# EAGLE schematic V1c_pcb (EAGLE 6.5.0)
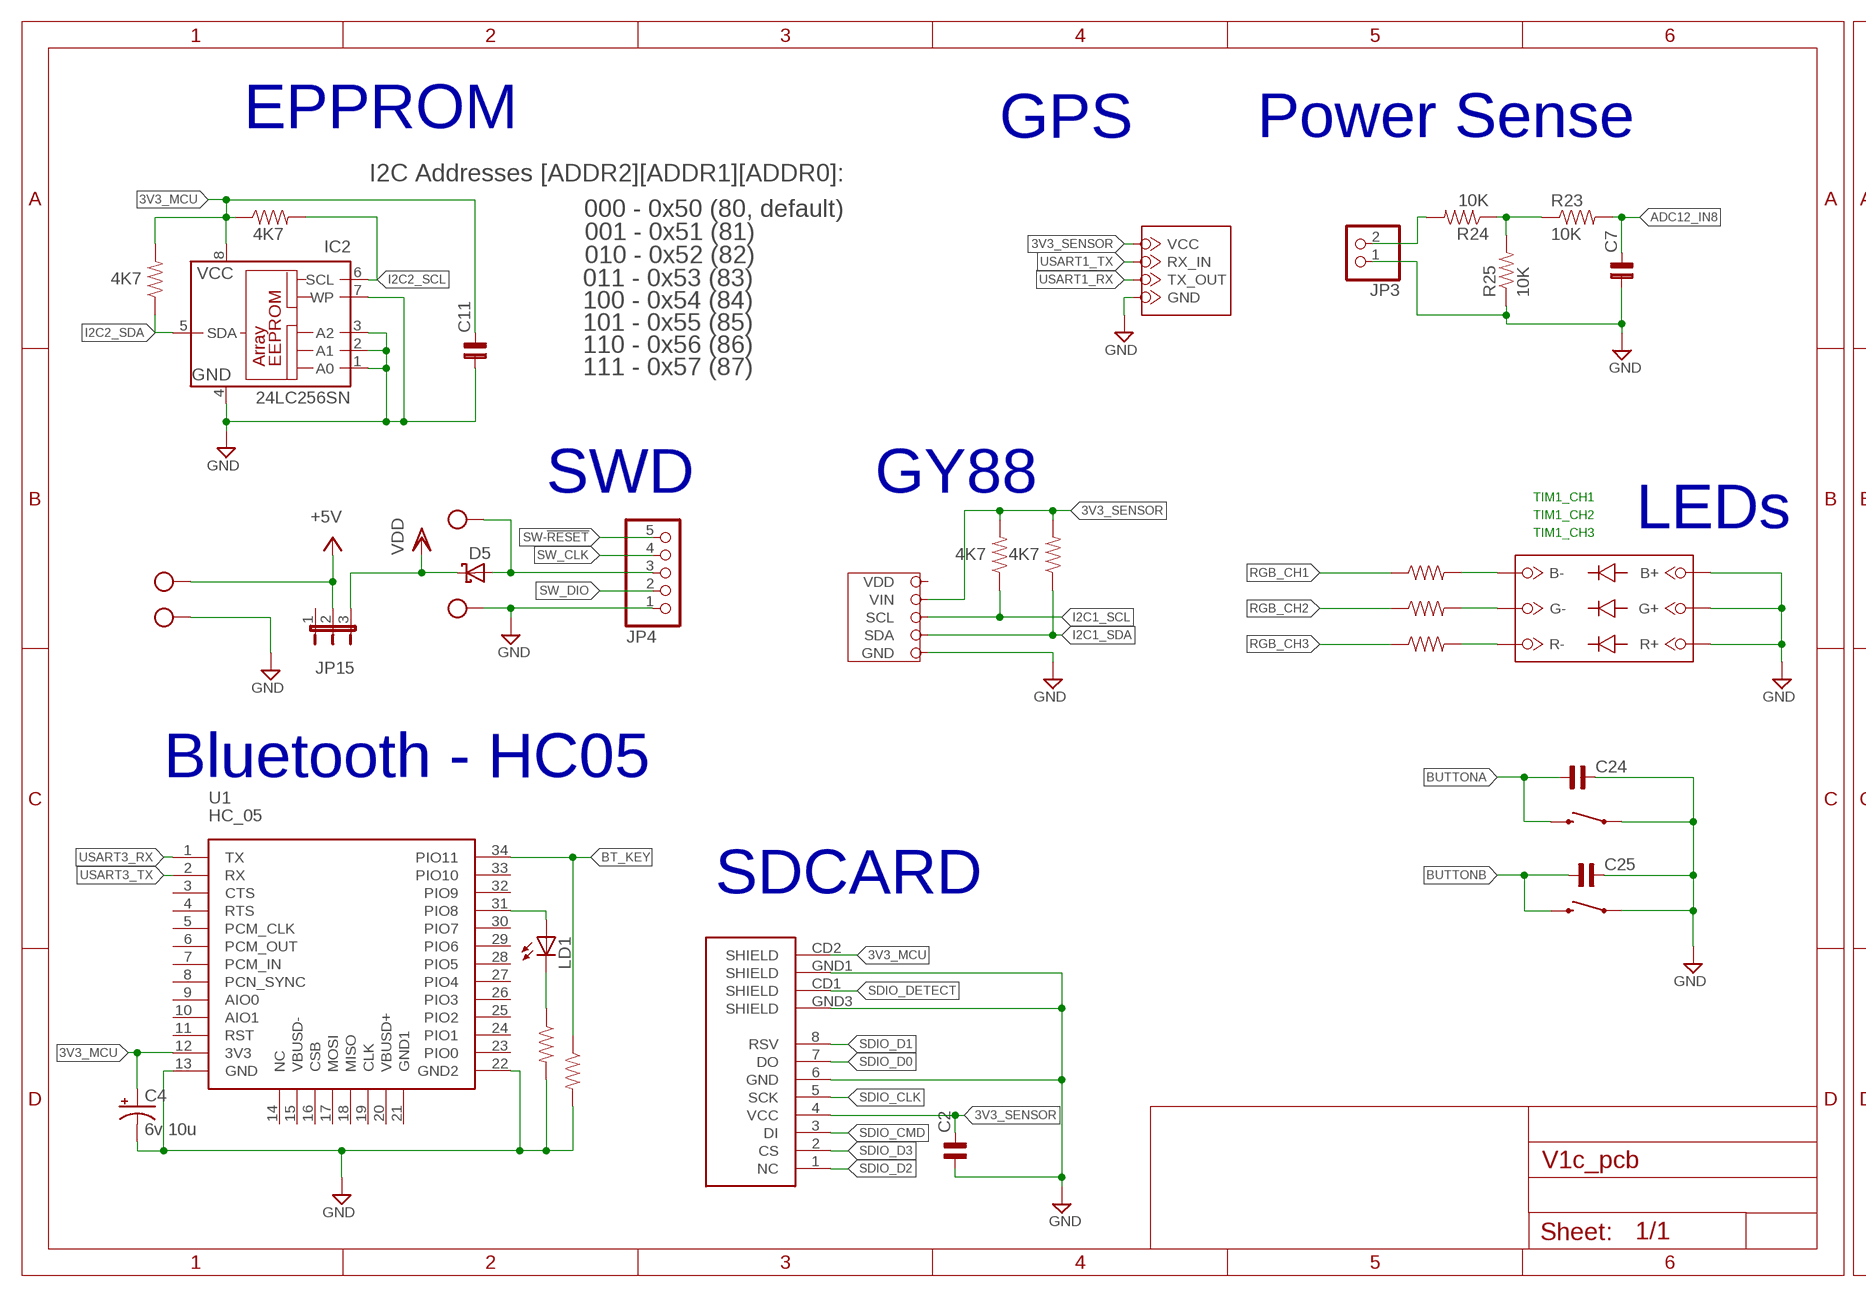
[diagram p0: schematic, sheet 1, part 1 of 2]
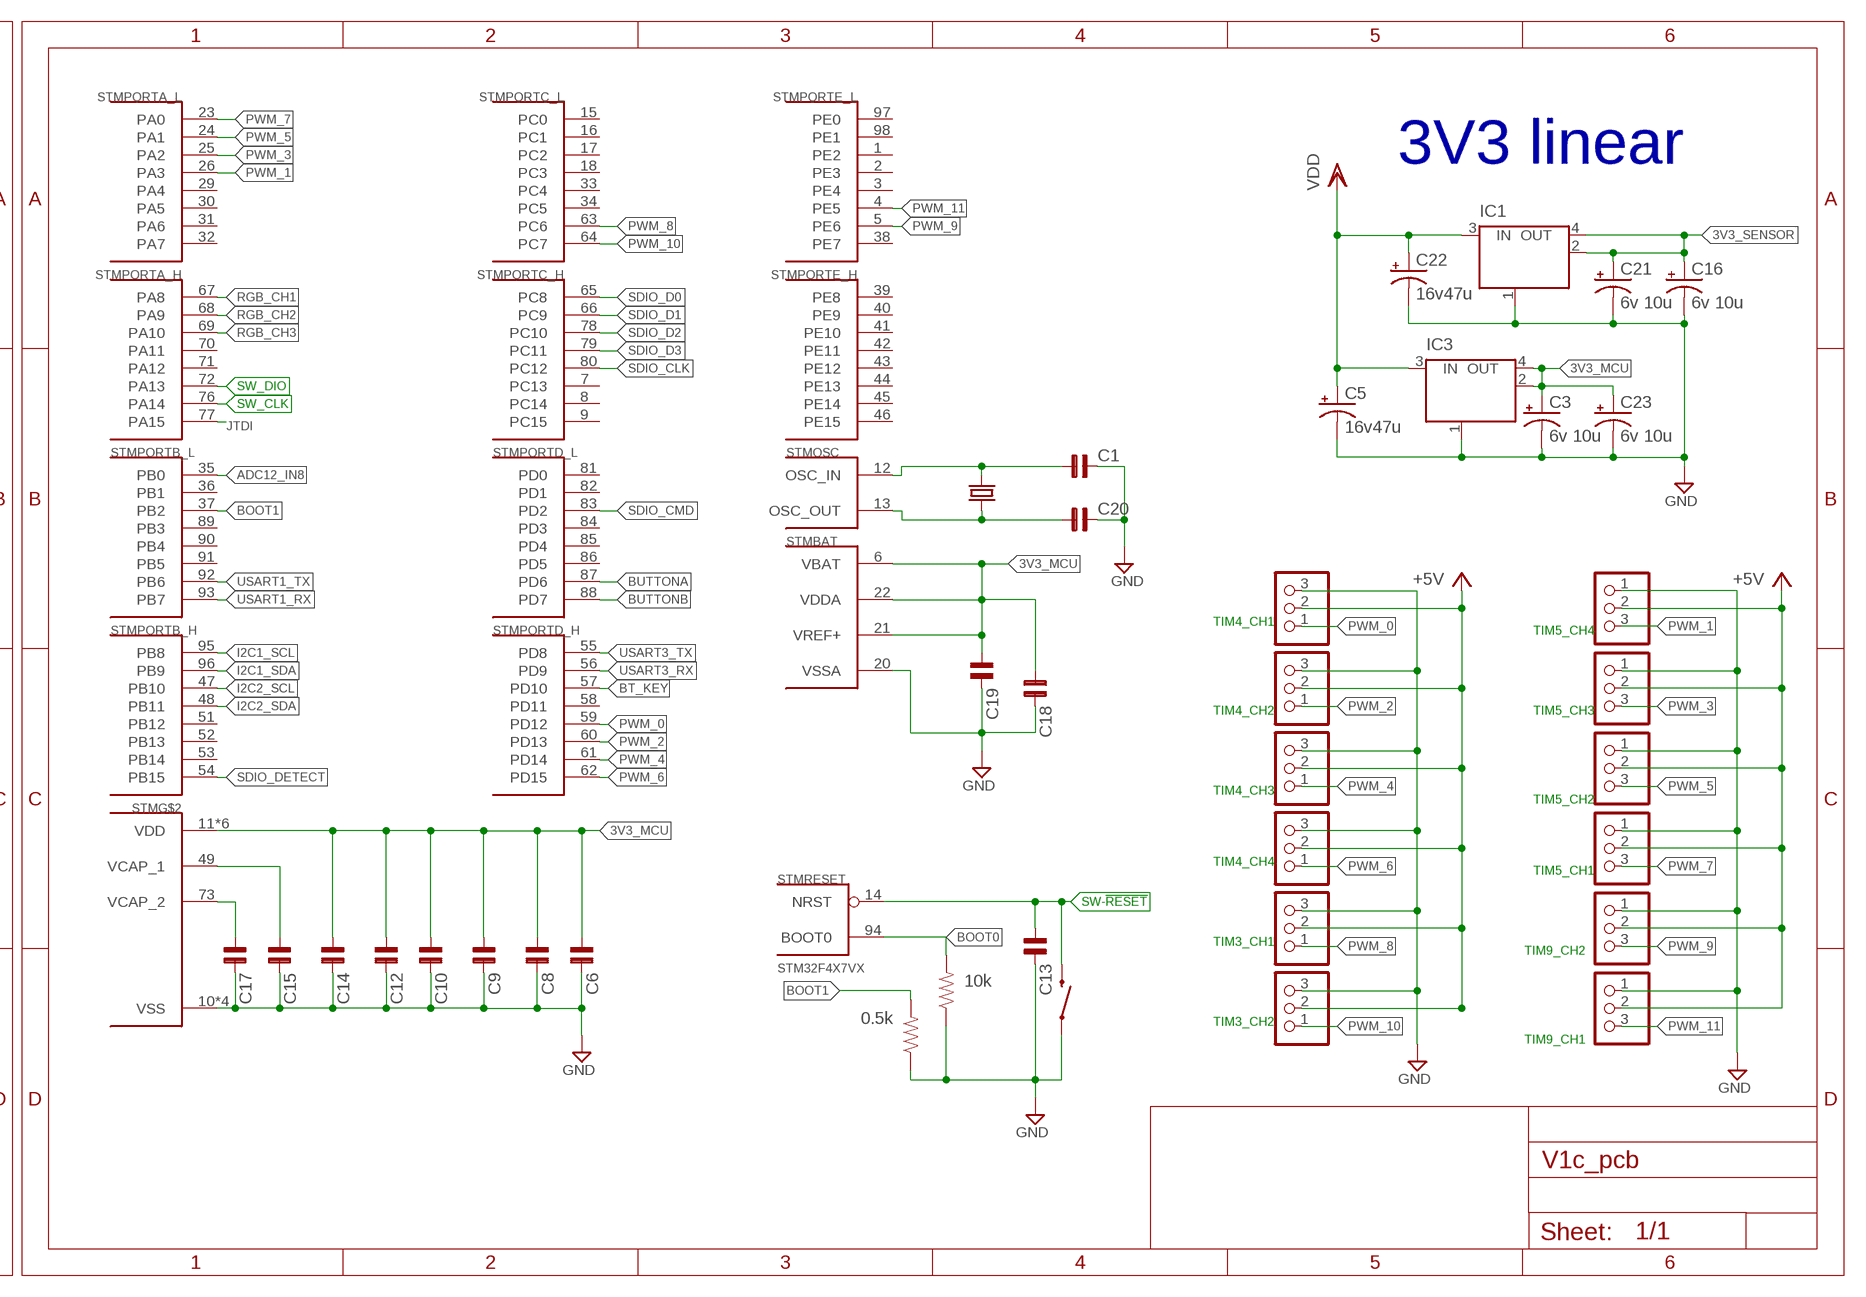
[diagram p1: schematic, sheet 1, part 2 of 2]

## Parts
C1  C-NP-SMD-0603  [C-0603]
C2  C-NP-SMD-0603  [C-0603]
C3  6v 10u  CPOL-USSMCA  [SMC_A]
C4  6v 10u  CPOL-USSMCA  [SMC_A]
C5  16v47u  CPOL-USSMCC  [SMC_C]
C6  C-NP-SMD-0603  [C-0603]
C7  C-NP-SMD-0603  [C-0603]
C8  C-NP-SMD-0603  [C-0603]
C9  C-NP-SMD-0603  [C-0603]
C10  C-NP-SMD-0603  [C-0603]
C11  C-NP-SMD-0603  [C-0603]
C12  C-NP-SMD-0603  [C-0603]
C13  C-NP-SMD-0603  [C-0603]
C14  C-NP-SMD-0603  [C-0603]
C15  C-NP-SMD-0603  [C-0603]
C16  6v 10u  CPOL-USSMCA  [SMC_A]
C17  C-NP-SMD-0603  [C-0603]
C18  C-NP-SMD-0603  [C-0603]
C19  C-NP-SMD-0603  [C-0603]
C20  C-NP-SMD-0603  [C-0603]
C21  6v 10u  CPOL-USSMCA  [SMC_A]
C22  16v47u  CPOL-USSMCC  [SMC_C]
C23  6v 10u  CPOL-USSMCA  [SMC_A]
C24  C-NP-SMD-0603  [C-0603]
C25  C-NP-SMD-0603  [C-0603]
D5  MBRS330T3  [SMC]
IC1  LINEAR_MC33269ST-3.3T3  [LINEAR_SOT223]
IC2  24LC256SN  [SO-08]
IC3  LINEAR_MC33269ST-3.3T3  [LINEAR_SOT223]
JP1  PINHD-1X3_2.54-90°  [1X03/90]
JP2  PINHD-1X3_2.54-90°  [1X03/90]
JP3  PINHD-1X2  [1X02]
JP4  PINHD-1X5_2.54-90°  [1X05/90]
JP5  PINHD-1X3_2.54-90°  [1X03/90]
JP6  PINHD-1X3_2.54-90°  [1X03/90]
JP7  PINHD-1X3_2.54-90°  [1X03/90]
JP8  PINHD-1X3_2.54-90°  [1X03/90]
JP9  PINHD-1X3_2.54-90°  [1X03/90]
JP10  PINHD-1X3_2.54-90°  [1X03/90]
JP11  PINHD-1X3_2.54-90°  [1X03/90]
JP12  PINHD-1X3_2.54-90°  [1X03/90]
JP13  PINHD-1X3_2.54-90°  [1X03/90]
JP14  PINHD-1X3_2.54-90°  [1X03/90]
JP15  JP2E  [JP2]
LD1  LEDCHIPLED_0805  [CHIPLED_0805]
R1  4K7  SPARKFUN_RESISTOR0603-RES  [SPARKFUN_0603-RES]
R2  10K  SPARKFUN_RESISTOR0603-RES  [SPARKFUN_0603-RES]
R3  10K  SPARKFUN_RESISTOR0603-RES  [SPARKFUN_0603-RES]
R4  4K7  SPARKFUN_RESISTOR0603-RES  [SPARKFUN_0603-RES]
R5  10K  SPARKFUN_RESISTOR0603-RES  [SPARKFUN_0603-RES]
R6  10K  SPARKFUN_RESISTOR0603-RES  [SPARKFUN_0603-RES]
R7  10k  SPARKFUN_RESISTOR0603-RES  [SPARKFUN_0603-RES]
R8  0.5k  SPARKFUN_RESISTOR0603-RES  [SPARKFUN_0603-RES]
R9  10K  SPARKFUN_RESISTOR0603-RES  [SPARKFUN_0603-RES]
R15  4K7  SPARKFUN_RESISTOR0603-RES  [SPARKFUN_0603-RES]
R16  4K7  SPARKFUN_RESISTOR0603-RES  [SPARKFUN_0603-RES]
R23  10K  SPARKFUN_RESISTOR0603-RES  [SPARKFUN_0603-RES]
R24  10K  SPARKFUN_RESISTOR0603-RES  [SPARKFUN_0603-RES]
R25  10K  SPARKFUN_RESISTOR0603-RES  [SPARKFUN_0603-RES]
S1  RESET  SWITCH-MOMENTARY-2-SMD-1101NE  [TACTILE-SWITCH-1101NE]
S2  RESET  SWITCH-MOMENTARY-2-SMD-1101NE  [TACTILE-SWITCH-1101NE]
S3  RESET  SWITCH-MOMENTARY-2-SMD-1101NE  [TACTILE-SWITCH-1101NE]
SDCARD2  microSD Socket  USD-SOCKETNEW  [MICRO-SD-SOCKET-PP]
STM  STM32F4X7VX  [TQFP100]
U1  HC_05  [BLUETOOTH_SMD]
U$1  GY-88  [BREAKOUT]
U$10  GPS_MODULE  [23X30]
U$12  RGB_LED  [SMD]
X1  MKDSN1,5/2-5,08  [MKDSN1,5/2-5,08]
X2  MKDSN1,5/2-5,08  [MKDSN1,5/2-5,08]
Y1  CRYSTALHC49US  [HC49US]

## Nets
3V3_MCU: C3.+ C4.+ C6.1 C8.1 C9.1 C10.1 C11.2 C12.1 C14.1 C18.1 C19.1 C23.+ IC2.8(VCC) IC3.2(OUT) IC3.4(OUT) R15.1 R16.2 SDCARD2.CD2(SHIELD) STM.6(BAT:VBAT) STM.11(VDD) STM.19(VDD) STM.21(BAT:VREF+) STM.22(BAT:VDDA) STM.28(VDD) STM.50(VDD) STM.75(VDD) STM.100(VDD) U1.12(3V3)
3V3_SENSOR: C2.2 C16.+ C21.+ IC1.2(OUT) IC1.4(OUT) R1.2 R4.2 SDCARD2.4(VCC) U$1.2(VIN) U$10.4(VCC)
+5V: JP1.2 JP2.2 JP5.2 JP6.2 JP7.2 JP8.2 JP9.2 JP10.2 JP11.2 JP12.2 JP13.2 JP14.2 JP15.2 X2.2
ADC12_IN8: C7.2 R23.2 STM.35(PORTB_L:PB0)
BOOT0: R7.2 STM.94(RESET:BOOT0)
BOOT1: R8.2 STM.37(PORTB_L:PB2)
BT_KEY: R5.1 STM.57(PORTD_H:PD10) U1.34(PIO11)
BUTTONA: C24.1 S3.P$2 STM.87(PORTD_L:PD6)
BUTTONB: C25.1 S2.P$2 STM.88(PORTD_L:PD7)
GND: C1.2 C2.1 C3.- C4.- C5.- C6.2 C7.1 C8.2 C9.2 C10.2 C11.1 C12.2 C13.2 C14.2 C15.2 C16.- C17.2 C18.2 C19.2 C20.2 C21.- C22.- C23.- C24.2 C25.2 IC1.1(GND/ADJ) IC2.1(A0) IC2.2(A1) IC2.3(A2) IC2.4(GND) IC2.7(WP) IC3.1(GND/ADJ) JP1.1 JP2.1 JP3.1 JP4.1 JP5.1 JP6.1 JP7.3 JP8.1 JP9.3 JP10.3 JP11.1 JP12.3 JP13.3 JP14.3 R5.2 R7.1 R8.1 R9.2 R25.1 S1.P$1 S2.P$1 S3.P$1 SDCARD2.6(GND) SDCARD2.GND1(SHIELD) SDCARD2.GND3(SHIELD) STM.10(VSS) STM.20(BAT:VSSA) STM.27(VSS) STM.74(VSS) STM.99(VSS) U1.13(GND) U1.22(GND2) U$1.3(GND) U$10.1(GND) U$12.B+ U$12.G+ U$12.R+ X1.2 X2.1
I2C1_SCL: R1.1 STM.95(PORTB_H:PB8) U$1.4(SCL)
I2C1_SDA: R4.1 STM.96(PORTB_H:PB9) U$1.5(SDA)
I2C2_SCL: IC2.6(SCL) R15.2 STM.47(PORTB_H:PB10)
I2C2_SDA: IC2.5(SDA) R16.1 STM.48(PORTB_H:PB11)
JTDI: STM.77(PORTA_H:PA15)
N$1: C1.1 STM.12(OSC:OSC_IN) Y1.2
N$2: R2.2 U$12.B-
N$3: JP3.2 R24.2
N$4: LD1.A U1.31(PIO8)
N$5: LD1.C R9.1
N$6: R3.2 U$12.G-
N$7: R6.2 U$12.R-
N$9: D5.A JP4.3 X1.1
N$27: R23.1 R24.1 R25.2
N$29: C20.1 STM.13(OSC:OSC_OUT) Y1.1
N$31: C17.1 STM.73(VCAP_2)
N$32: C15.1 STM.49(VCAP_1)
PWM_0: JP7.1 STM.59(PORTD_H:PD12)
PWM_1: JP6.3 STM.26(PORTA_L:PA3)
PWM_2: JP9.1 STM.60(PORTD_H:PD13)
PWM_3: JP11.3 STM.25(PORTA_L:PA2)
PWM_4: JP10.1 STM.61(PORTD_H:PD14)
PWM_5: JP5.3 STM.24(PORTA_L:PA1)
PWM_6: JP12.1 STM.62(PORTD_H:PD15)
PWM_7: JP1.3 STM.23(PORTA_L:PA0)
PWM_8: JP13.1 STM.63(PORTC_L:PC6)
PWM_9: JP8.3 STM.5(PORTE_L:PE6)
PWM_10: JP14.1 STM.64(PORTC_L:PC7)
PWM_11: JP2.3 STM.4(PORTE_L:PE5)
RGB_CH1: R2.1 STM.67(PORTA_H:PA8)
RGB_CH2: R3.1 STM.68(PORTA_H:PA9)
RGB_CH3: R6.1 STM.69(PORTA_H:PA10)
SDIO_CLK: SDCARD2.5(SCK) STM.80(PORTC_H:PC12)
SDIO_CMD: SDCARD2.3(DI) STM.83(PORTD_L:PD2)
SDIO_D0: SDCARD2.7(DO) STM.65(PORTC_H:PC8)
SDIO_D1: SDCARD2.8(RSV) STM.66(PORTC_H:PC9)
SDIO_D2: SDCARD2.1(NC) STM.78(PORTC_H:PC10)
SDIO_D3: SDCARD2.2(CS) STM.79(PORTC_H:PC11)
SDIO_DETECT: SDCARD2.CD1(SHIELD) STM.54(PORTB_H:PB15)
SW-!RESET: C13.1 JP4.5 S1.P$2 STM.14(RESET:NRST)
SW_CLK: JP4.4 STM.76(PORTA_H:PA14)
SW_DIO: JP4.2 STM.72(PORTA_H:PA13)
USART1_RX: STM.93(PORTB_L:PB7) U$10.2(TX_OUT)
USART1_TX: STM.92(PORTB_L:PB6) U$10.3(RX_IN)
USART3_RX: STM.56(PORTD_H:PD9) U1.1(TX)
USART3_TX: STM.55(PORTD_H:PD8) U1.2(RX)
VDD: C5.+ C22.+ D5.C IC1.3(IN) IC3.3(IN) JP15.3
Unconnected: JP15.1 STM.1(PORTE_L:PE2) STM.2(PORTE_L:PE3) STM.3(PORTE_L:PE4) STM.7(PORTC_H:PC13) STM.8(PORTC_H:PC14) STM.9(PORTC_H:PC15) STM.15(PORTC_L:PC0) STM.16(PORTC_L:PC1) STM.17(PORTC_L:PC2) STM.18(PORTC_L:PC3) STM.29(PORTA_L:PA4) STM.30(PORTA_L:PA5) STM.31(PORTA_L:PA6) STM.32(PORTA_L:PA7) STM.33(PORTC_L:PC4) STM.34(PORTC_L:PC5) STM.36(PORTB_L:PB1) STM.38(PORTE_L:PE7) STM.39(PORTE_H:PE8) STM.40(PORTE_H:PE9) STM.41(PORTE_H:PE10) STM.42(PORTE_H:PE11) STM.43(PORTE_H:PE12) STM.44(PORTE_H:PE13) STM.45(PORTE_H:PE14) STM.46(PORTE_H:PE15) STM.51(PORTB_H:PB12) STM.52(PORTB_H:PB13) STM.53(PORTB_H:PB14) STM.58(PORTD_H:PD11) STM.70(PORTA_H:PA11) STM.71(PORTA_H:PA12) STM.81(PORTD_L:PD0) STM.82(PORTD_L:PD1) STM.84(PORTD_L:PD3) STM.85(PORTD_L:PD4) STM.86(PORTD_L:PD5) STM.89(PORTB_L:PB3) STM.90(PORTB_L:PB4) STM.91(PORTB_L:PB5) STM.97(PORTE_L:PE0) STM.98(PORTE_L:PE1) U1.3(CTS) U1.4(RTS) U1.5(PCM_CLK) U1.6(PCM_OUT) U1.7(PCM_IN) U1.8(PCN_SYNC) U1.9(AIO0) U1.10(AIO1) U1.11(RST) U1.14(NC) U1.15(VBUSD-) U1.16(CSB) U1.17(MOSI) U1.18(MISO) U1.19(CLK) U1.20(VBUSD+) U1.21(GND1) U1.23(PIO0) U1.24(PIO1) U1.25(PIO2) U1.26(PIO3) U1.27(PIO4) U1.28(PIO5) U1.29(PIO6) U1.30(PIO7) U1.32(PIO9) U1.33(PIO10) U$1.1(VDD)

## Notes on the sheet
- GPS
- EPPROM | Power Sense
- 3V3 linear
- I2C Addresses [ADDR2][ADDR1][ADDR0]:
- 000 - 0x50 (80, default)
- 001 - 0x51 (81)
- 010 - 0x52 (82)
- 011 - 0x53 (83)
- 100 - 0x54 (84)
- 101 - 0x55 (85)
- 110 - 0x56 (86)
- 111 - 0x57 (87)
- SWD | GY88
- TIM1_CH1
- TIM1_CH2
- LEDs
- TIM1_CH3
- TIM4_CH1
- TIM5_CH4
- TIM4_CH2 | TIM5_CH3
- Bluetooth - HC05
- TIM4_CH3
- TIM5_CH2
- SDCARD
- TIM4_CH4
- TIM5_CH1
- TIM3_CH1
- TIM9_CH2
- TIM3_CH2
- TIM9_CH1
- TJA1040

## Library data of the parts
C1 C2 C6-C15 C17-C20 C24 C25 = cap-pan40:C-NP: NON-POLARIZED FILM/CHIP
C3-C5 C16 C21-C23 = rcl:CPOL-US: POLARIZED CAPACITOR, American symbol
D5 = Robotech Diode of Chung:MBRS3*0T3: SCHOTTKY BARRIER RECTIFIER 3.0 AMPERES 20, 30, 40 VOLT Source: MBRS340T3-D.pdf
IC1 IC3 = Robotech_Other:LINEAR_MC33269ST*: Adjustable Output Low Dropout Voltage Regulator 800 mA Source: http://www.onsemi.com/pub/Collateral/MC33269-D.PDF
IC2 = microchip:24*: Serial EEPROM I2C; DIGIKEY: 24LC256-E/SN-ND; MF: MICROCHIP; MPN: 24LC256-I/SN; OC_FARNELL: 9757996; OC_NEWARK: 27C9144
JP1 JP2 JP5-JP14 = pinhead-1:PINHD-1X3: PIN HEADER
JP3 = pinhead:PINHD-1X2: PIN HEADER
JP4 = pinhead-1:PINHD-1X5: PIN HEADER
JP15 = jumper:JP2E: JUMPER
LD1 = led:LED: LED OSRAM: - CHIPLED LG R971, LG N971, LY N971, LG Q971, LY Q971, LO R971, LY R971 LH N974, LH R974 LS Q976, LO Q976, LY Q976 LO Q996 - Hyper CHIPLED LW Q18S LB Q993, LB Q99A, LB R99A - SideLED LS A670, LO A670, LY A670, LG A670, LP A670 LB A673, LV A673, LT A673, LW A673 LH A674 LY A675 LS A676, LA A676, LO A676, LY A676, LW A676 LS A679, LY A679, LG A679 - Hyper Micro SIDELED® LS Y876, LA Y876, LO Y876, LY Y876 LT Y87S - SmartLED LW L88C, LW L88S LB L89C, LB L89S, LG L890 LS L89K, LO L89K, LY L89K LS L896, LA L896, LO L896, LY L896 - TOPLED LS T670, LO T670, LY T670, LG T670, LP T670 LSG T670, LSP T670, LSY T670, LOP T670, LYG T670 LG T671, LOG T671, LSG T671 LB T673, LV T673, LT T673, LW T673 LH T674 LS T676, LA T676, LO T676, LY T676, LB T676, LH T676, LSB T676, LW T676 LB T67C, LV T67C, LT T67C, LS T67K, LO T67K, LY T67K, LW E67C LS E67B, LA E67B, LO E67B, LY E67B, LB E67C, LV E67C, LT E67C LW T67C LS T679, LY T679, LG T679 LS T770, LO T770, LY T770, LG T770, LP T770 LB T773, LV T773, LT T773, LW T773 LH T774 LS E675, LA E675, LY E675, LS T675 LS T776, LA T776, LO T776, LY T776, LB T776 LHGB T686 LT T68C, LB T68C - Hyper Mini TOPLED® LB M676 - Mini TOPLED Santana® LG M470 LS M47K, LO M47K, LY M47K Source: http://www.osram.convergy.de/
R1-R9 R15 R16 R23-R25 = Robotech_RCL:SPARKFUN_RESISTOR: Resistor Basic schematic elements and footprints for 0603, 1206, and PTH resistors.
S1-S3 = pixhawk2:SWITCH-MOMENTARY-2; PARTNO: EVQ-P7J01P
SDCARD2 = SparkFun:USD-SOCKET: microSD Socket Push-push type uSD socket. Schematic element and footprint production proven. Spark Fun Electronics SKU : PRT-00127. tDoc lines correctly indicate media card edge positions when inserting (unlocked, locked, depressed).
STM = pixhawk2:STM32F4X7VX: STM32F4X7VX 100 pin LQFP STM32F407VE - 512 KB flash, no crypto STM32F407VG - 1 MB flash, no crypto STM32F417VE - 512 KB flash, with crypto STM32F417VG - 1 MB flash, with crypto; PARTNO: STM32F427VI
U1 = SerialPortBluetooth:HC_05
U$1 = GY88:GY-88
U$10 = GPS_module:GPS_MODULE
U$12 = RGB_LED:RGB_LED
X1 X2 = con-phoenix-508:MKDSN1,5/2-5,08: MKDSN 1,5/ 2-5,08 Printklemme Nennstrom: 13,5 A Nennspannung: 250 V Rastermaß: 5,08 mm Polzahl: 2 Anschlussart: Schraubanschluss Montage: Löten Anschlussrichtung Leiter/Platine: 0 ° Artikelnummer: 1729128 Source: http://eshop.phoenixcontact.com .. 1729128.pdf; MPN: MKDSN 1,5/2-5.08; OC_FARNELL: 1792903; OC_NEWARK: 30M2397
Y1 = SparkFun-FreqCtrl:CRYSTAL: Various standard crystals. Proven footprints. Spark Fun Electronics SKU : COM-00534

## Net classes
0 Default: width 0.203 mm
1 power: width 0.15 mm, drill 0.2 mm, clearance 0.152 mm